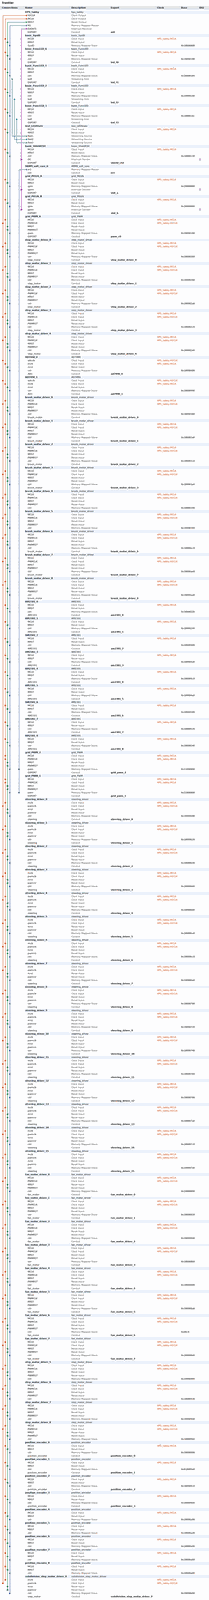
[diagram p0: system contents, whole]
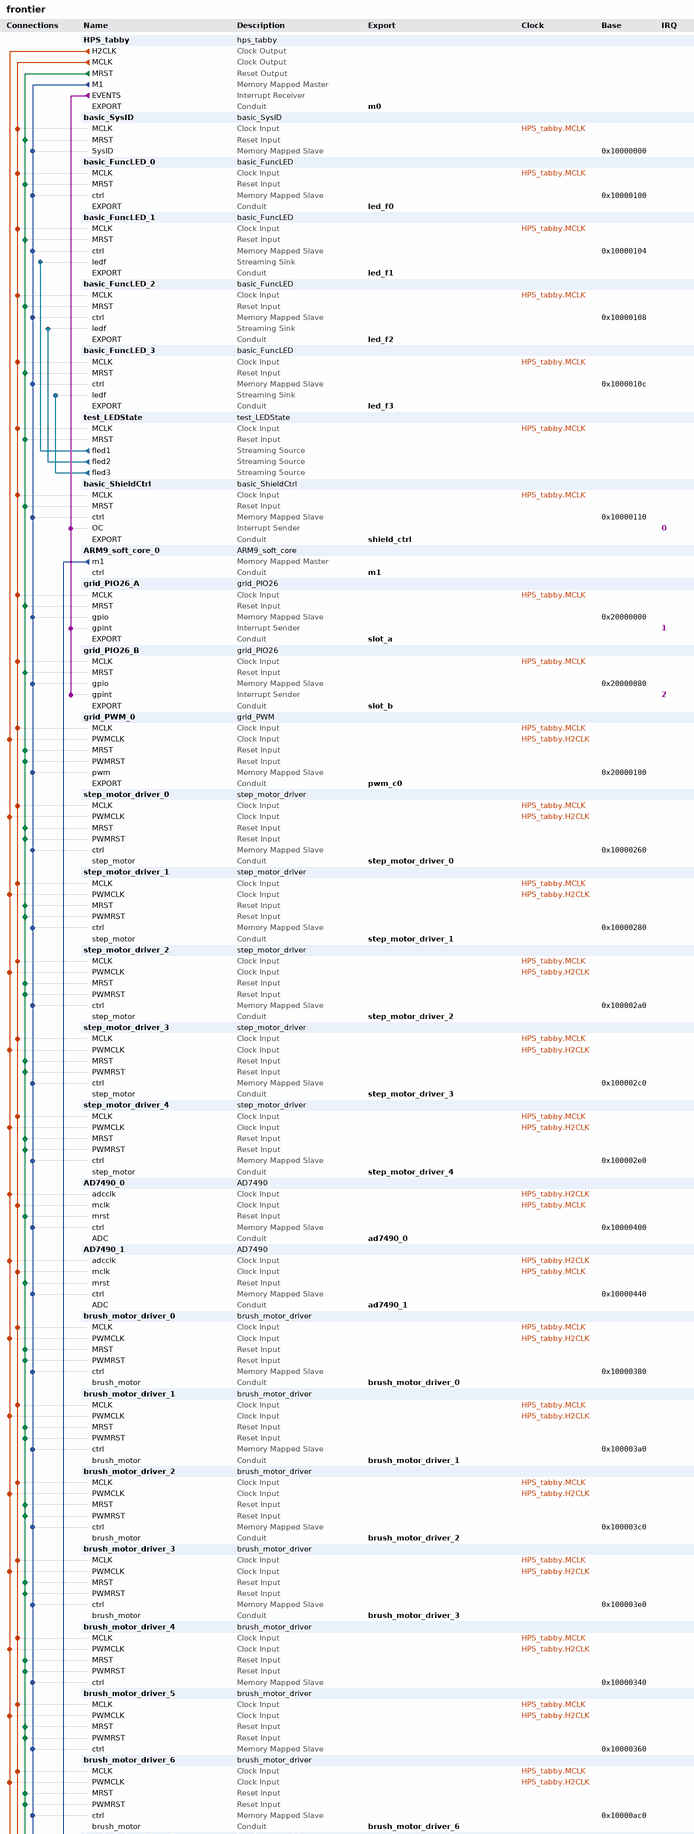
[diagram p1: system contents, upper part]
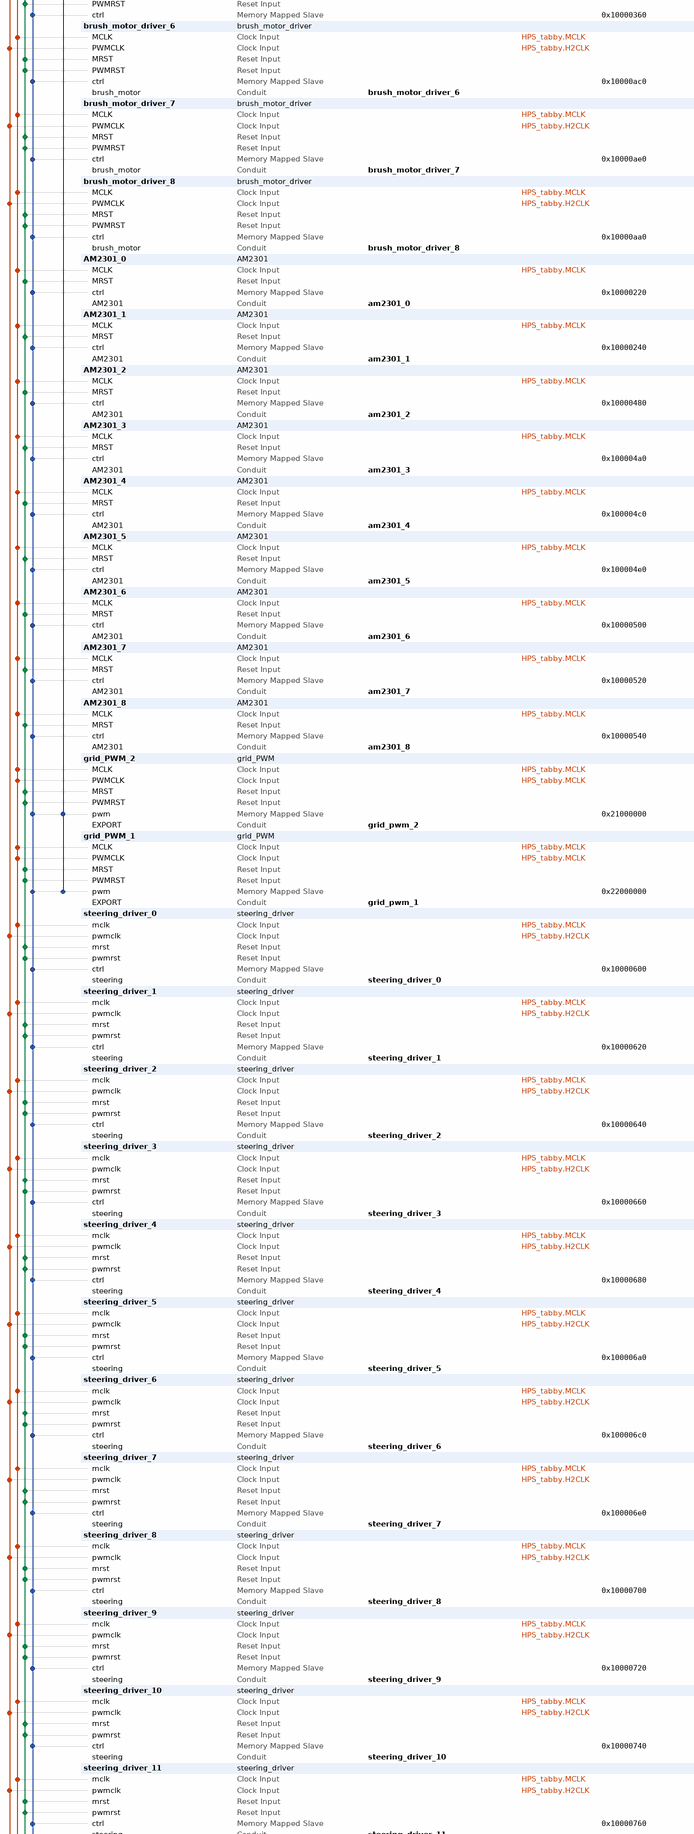
[diagram p2: system contents, middle part]
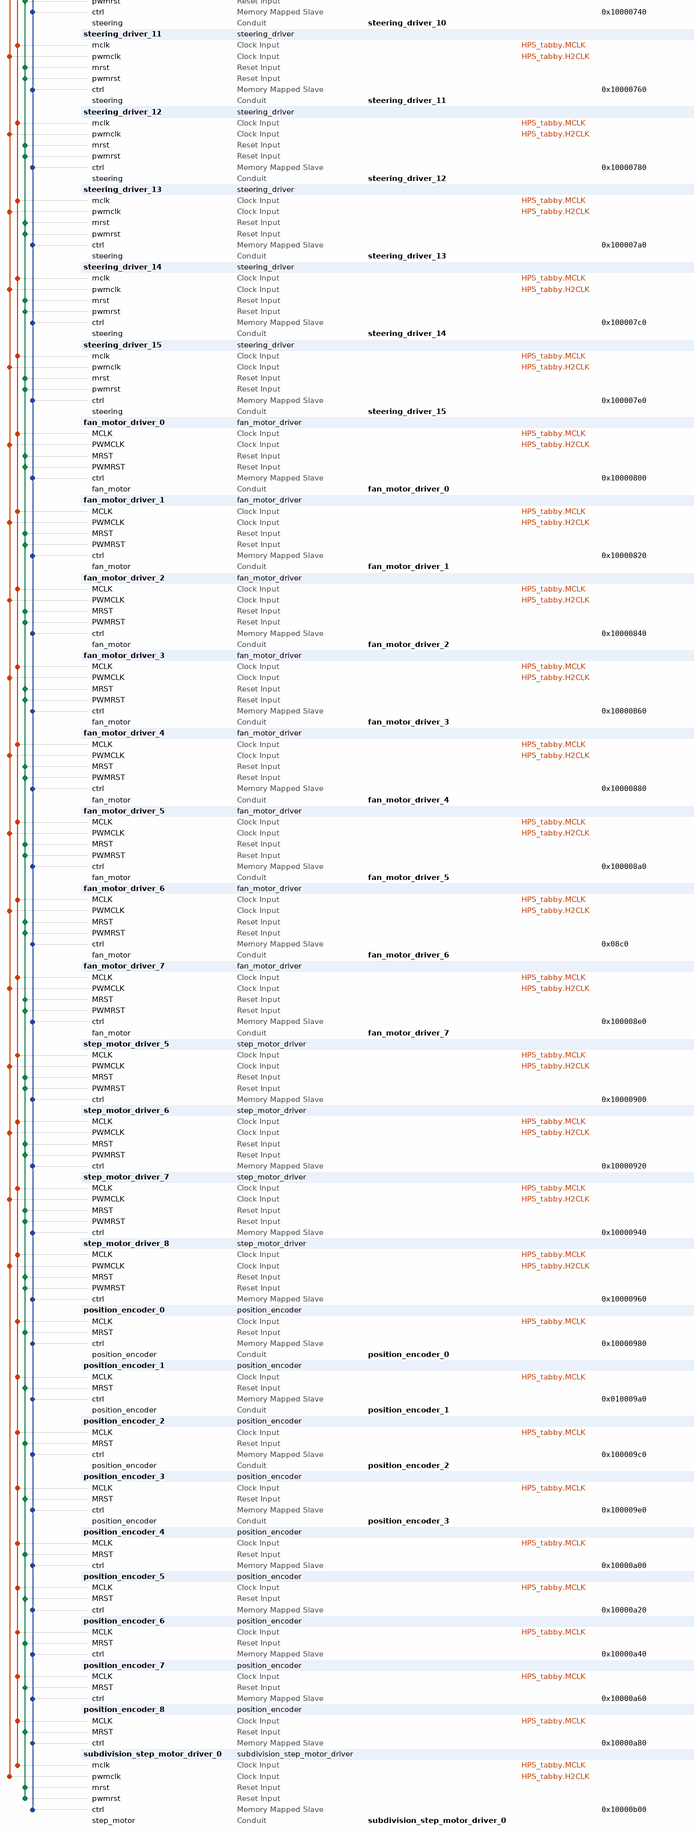
[diagram p3: system contents, lower part]
# Platform Designer (Qsys) system frontier, Cyclone IV E EP4CE15F23C8
# Parameters at their usual value, and those the tool derives, are not listed.
package require qsys
create_system frontier
set_project_property DEVICE_FAMILY {Cyclone IV E}
set_project_property DEVICE EP4CE15F23C8

add_instance HPS_tabby hps_tabby 1.1

add_instance basic_SysID basic_SysID 1.0

add_instance basic_FuncLED_0 basic_FuncLED 1.0

add_instance basic_FuncLED_1 basic_FuncLED 1.0

add_instance basic_FuncLED_2 basic_FuncLED 1.0

add_instance basic_FuncLED_3 basic_FuncLED 1.0

add_instance test_LEDState test_LEDState 1.0

add_instance basic_ShieldCtrl basic_ShieldCtrl 1.0

add_instance ARM9_soft_core_0 ARM9_soft_core 1.0

add_instance grid_PIO26_A grid_PIO26 1.0

add_instance grid_PIO26_B grid_PIO26 1.0

add_instance grid_PWM_0 grid_PWM 1.0

add_instance step_motor_driver_0 step_motor_driver 1.0

add_instance step_motor_driver_1 step_motor_driver 1.0

add_instance step_motor_driver_2 step_motor_driver 1.0

add_instance step_motor_driver_3 step_motor_driver 1.0

add_instance step_motor_driver_4 step_motor_driver 1.0

add_instance AD7490_0 AD7490 1.0

add_instance AD7490_1 AD7490 1.0

add_instance brush_motor_driver_0 brush_motor_driver 1.0

add_instance brush_motor_driver_1 brush_motor_driver 1.0

add_instance brush_motor_driver_2 brush_motor_driver 1.0

add_instance brush_motor_driver_3 brush_motor_driver 1.0

add_instance brush_motor_driver_4 brush_motor_driver 1.0

add_instance brush_motor_driver_5 brush_motor_driver 1.0

add_instance brush_motor_driver_6 brush_motor_driver 1.0

add_instance brush_motor_driver_7 brush_motor_driver 1.0

add_instance brush_motor_driver_8 brush_motor_driver 1.0

add_instance AM2301_0 AM2301 1.0
set_instance_parameter_value AM2301_0 high_width 20
set_instance_parameter_value AM2301_0 start_width 1000
set_instance_parameter_value AM2301_0 start 0
set_instance_parameter_value AM2301_0 start_read 1
set_instance_parameter_value AM2301_0 start_end 2
set_instance_parameter_value AM2301_0 start_low 3
set_instance_parameter_value AM2301_0 start_high 4
set_instance_parameter_value AM2301_0 bit_1_low 5
set_instance_parameter_value AM2301_0 bit_1_high 6
set_instance_parameter_value AM2301_0 bit_2_low 7
set_instance_parameter_value AM2301_0 bit_2_high 8
set_instance_parameter_value AM2301_0 bit_3_low 9
set_instance_parameter_value AM2301_0 bit_3_high 10
set_instance_parameter_value AM2301_0 bit_4_low 11
set_instance_parameter_value AM2301_0 bit_4_high 12
set_instance_parameter_value AM2301_0 bit_5_low 13
set_instance_parameter_value AM2301_0 bit_5_high 14
set_instance_parameter_value AM2301_0 bit_6_low 15
set_instance_parameter_value AM2301_0 bit_6_high 16
set_instance_parameter_value AM2301_0 bit_7_low 17
set_instance_parameter_value AM2301_0 bit_7_high 18
set_instance_parameter_value AM2301_0 bit_8_low 19
set_instance_parameter_value AM2301_0 bit_8_high 20
set_instance_parameter_value AM2301_0 bit_9_low 21
set_instance_parameter_value AM2301_0 bit_9_high 22
set_instance_parameter_value AM2301_0 bit_10_low 23
set_instance_parameter_value AM2301_0 bit_10_high 24
set_instance_parameter_value AM2301_0 bit_11_low 25
set_instance_parameter_value AM2301_0 bit_11_high 26
set_instance_parameter_value AM2301_0 bit_12_low 27
set_instance_parameter_value AM2301_0 bit_12_high 28
set_instance_parameter_value AM2301_0 bit_13_low 29
set_instance_parameter_value AM2301_0 bit_13_high 30
set_instance_parameter_value AM2301_0 bit_14_low 31
set_instance_parameter_value AM2301_0 bit_14_high 32
set_instance_parameter_value AM2301_0 bit_15_low 33
set_instance_parameter_value AM2301_0 bit_15_high 34
set_instance_parameter_value AM2301_0 bit_16_low 35
set_instance_parameter_value AM2301_0 bit_16_high 36
set_instance_parameter_value AM2301_0 bit_17_low 37
set_instance_parameter_value AM2301_0 bit_17_high 38
set_instance_parameter_value AM2301_0 bit_18_low 39
set_instance_parameter_value AM2301_0 bit_18_high 40
set_instance_parameter_value AM2301_0 bit_19_low 41
set_instance_parameter_value AM2301_0 bit_19_high 42
set_instance_parameter_value AM2301_0 bit_20_low 43
set_instance_parameter_value AM2301_0 bit_20_high 44
set_instance_parameter_value AM2301_0 bit_21_low 45
set_instance_parameter_value AM2301_0 bit_21_high 46
set_instance_parameter_value AM2301_0 bit_22_low 47
set_instance_parameter_value AM2301_0 bit_22_high 48
set_instance_parameter_value AM2301_0 bit_23_low 49
set_instance_parameter_value AM2301_0 bit_23_high 50
set_instance_parameter_value AM2301_0 bit_24_low 51
set_instance_parameter_value AM2301_0 bit_24_high 52
set_instance_parameter_value AM2301_0 bit_25_low 53
set_instance_parameter_value AM2301_0 bit_25_high 54
set_instance_parameter_value AM2301_0 bit_26_low 55
set_instance_parameter_value AM2301_0 bit_26_high 56
set_instance_parameter_value AM2301_0 bit_27_low 57
set_instance_parameter_value AM2301_0 bit_27_high 58
set_instance_parameter_value AM2301_0 bit_28_low 59
set_instance_parameter_value AM2301_0 bit_28_high 60
set_instance_parameter_value AM2301_0 bit_29_low 61
set_instance_parameter_value AM2301_0 bit_29_high 62
set_instance_parameter_value AM2301_0 bit_30_low 63
set_instance_parameter_value AM2301_0 bit_30_high 64
set_instance_parameter_value AM2301_0 bit_31_low 65
set_instance_parameter_value AM2301_0 bit_31_high 66
set_instance_parameter_value AM2301_0 bit_32_low 67
set_instance_parameter_value AM2301_0 bit_32_high 68
set_instance_parameter_value AM2301_0 ready 90
set_instance_parameter_value AM2301_0 time_2s 2000000

add_instance AM2301_1 AM2301 1.0
set_instance_parameter_value AM2301_1 high_width 20
set_instance_parameter_value AM2301_1 start_width 1000
set_instance_parameter_value AM2301_1 start 0
set_instance_parameter_value AM2301_1 start_read 1
set_instance_parameter_value AM2301_1 start_end 2
set_instance_parameter_value AM2301_1 start_low 3
set_instance_parameter_value AM2301_1 start_high 4
set_instance_parameter_value AM2301_1 bit_1_low 5
set_instance_parameter_value AM2301_1 bit_1_high 6
set_instance_parameter_value AM2301_1 bit_2_low 7
set_instance_parameter_value AM2301_1 bit_2_high 8
set_instance_parameter_value AM2301_1 bit_3_low 9
set_instance_parameter_value AM2301_1 bit_3_high 10
set_instance_parameter_value AM2301_1 bit_4_low 11
set_instance_parameter_value AM2301_1 bit_4_high 12
set_instance_parameter_value AM2301_1 bit_5_low 13
set_instance_parameter_value AM2301_1 bit_5_high 14
set_instance_parameter_value AM2301_1 bit_6_low 15
set_instance_parameter_value AM2301_1 bit_6_high 16
set_instance_parameter_value AM2301_1 bit_7_low 17
set_instance_parameter_value AM2301_1 bit_7_high 18
set_instance_parameter_value AM2301_1 bit_8_low 19
set_instance_parameter_value AM2301_1 bit_8_high 20
set_instance_parameter_value AM2301_1 bit_9_low 21
set_instance_parameter_value AM2301_1 bit_9_high 22
set_instance_parameter_value AM2301_1 bit_10_low 23
set_instance_parameter_value AM2301_1 bit_10_high 24
set_instance_parameter_value AM2301_1 bit_11_low 25
set_instance_parameter_value AM2301_1 bit_11_high 26
set_instance_parameter_value AM2301_1 bit_12_low 27
set_instance_parameter_value AM2301_1 bit_12_high 28
set_instance_parameter_value AM2301_1 bit_13_low 29
set_instance_parameter_value AM2301_1 bit_13_high 30
set_instance_parameter_value AM2301_1 bit_14_low 31
set_instance_parameter_value AM2301_1 bit_14_high 32
set_instance_parameter_value AM2301_1 bit_15_low 33
set_instance_parameter_value AM2301_1 bit_15_high 34
set_instance_parameter_value AM2301_1 bit_16_low 35
set_instance_parameter_value AM2301_1 bit_16_high 36
set_instance_parameter_value AM2301_1 bit_17_low 37
set_instance_parameter_value AM2301_1 bit_17_high 38
set_instance_parameter_value AM2301_1 bit_18_low 39
set_instance_parameter_value AM2301_1 bit_18_high 40
set_instance_parameter_value AM2301_1 bit_19_low 41
set_instance_parameter_value AM2301_1 bit_19_high 42
set_instance_parameter_value AM2301_1 bit_20_low 43
set_instance_parameter_value AM2301_1 bit_20_high 44
set_instance_parameter_value AM2301_1 bit_21_low 45
set_instance_parameter_value AM2301_1 bit_21_high 46
set_instance_parameter_value AM2301_1 bit_22_low 47
set_instance_parameter_value AM2301_1 bit_22_high 48
set_instance_parameter_value AM2301_1 bit_23_low 49
set_instance_parameter_value AM2301_1 bit_23_high 50
set_instance_parameter_value AM2301_1 bit_24_low 51
set_instance_parameter_value AM2301_1 bit_24_high 52
set_instance_parameter_value AM2301_1 bit_25_low 53
set_instance_parameter_value AM2301_1 bit_25_high 54
set_instance_parameter_value AM2301_1 bit_26_low 55
set_instance_parameter_value AM2301_1 bit_26_high 56
set_instance_parameter_value AM2301_1 bit_27_low 57
set_instance_parameter_value AM2301_1 bit_27_high 58
set_instance_parameter_value AM2301_1 bit_28_low 59
set_instance_parameter_value AM2301_1 bit_28_high 60
set_instance_parameter_value AM2301_1 bit_29_low 61
set_instance_parameter_value AM2301_1 bit_29_high 62
set_instance_parameter_value AM2301_1 bit_30_low 63
set_instance_parameter_value AM2301_1 bit_30_high 64
set_instance_parameter_value AM2301_1 bit_31_low 65
set_instance_parameter_value AM2301_1 bit_31_high 66
set_instance_parameter_value AM2301_1 bit_32_low 67
set_instance_parameter_value AM2301_1 bit_32_high 68
set_instance_parameter_value AM2301_1 ready 90
set_instance_parameter_value AM2301_1 time_2s 2000000

add_instance AM2301_2 AM2301 1.0
set_instance_parameter_value AM2301_2 high_width 20
set_instance_parameter_value AM2301_2 start_width 1000
set_instance_parameter_value AM2301_2 start 0
set_instance_parameter_value AM2301_2 start_read 1
set_instance_parameter_value AM2301_2 start_end 2
set_instance_parameter_value AM2301_2 start_low 3
set_instance_parameter_value AM2301_2 start_high 4
set_instance_parameter_value AM2301_2 bit_1_low 5
set_instance_parameter_value AM2301_2 bit_1_high 6
set_instance_parameter_value AM2301_2 bit_2_low 7
set_instance_parameter_value AM2301_2 bit_2_high 8
set_instance_parameter_value AM2301_2 bit_3_low 9
set_instance_parameter_value AM2301_2 bit_3_high 10
set_instance_parameter_value AM2301_2 bit_4_low 11
set_instance_parameter_value AM2301_2 bit_4_high 12
set_instance_parameter_value AM2301_2 bit_5_low 13
set_instance_parameter_value AM2301_2 bit_5_high 14
set_instance_parameter_value AM2301_2 bit_6_low 15
set_instance_parameter_value AM2301_2 bit_6_high 16
set_instance_parameter_value AM2301_2 bit_7_low 17
set_instance_parameter_value AM2301_2 bit_7_high 18
set_instance_parameter_value AM2301_2 bit_8_low 19
set_instance_parameter_value AM2301_2 bit_8_high 20
set_instance_parameter_value AM2301_2 bit_9_low 21
set_instance_parameter_value AM2301_2 bit_9_high 22
set_instance_parameter_value AM2301_2 bit_10_low 23
set_instance_parameter_value AM2301_2 bit_10_high 24
set_instance_parameter_value AM2301_2 bit_11_low 25
set_instance_parameter_value AM2301_2 bit_11_high 26
set_instance_parameter_value AM2301_2 bit_12_low 27
set_instance_parameter_value AM2301_2 bit_12_high 28
set_instance_parameter_value AM2301_2 bit_13_low 29
set_instance_parameter_value AM2301_2 bit_13_high 30
set_instance_parameter_value AM2301_2 bit_14_low 31
set_instance_parameter_value AM2301_2 bit_14_high 32
set_instance_parameter_value AM2301_2 bit_15_low 33
set_instance_parameter_value AM2301_2 bit_15_high 34
set_instance_parameter_value AM2301_2 bit_16_low 35
set_instance_parameter_value AM2301_2 bit_16_high 36
set_instance_parameter_value AM2301_2 bit_17_low 37
set_instance_parameter_value AM2301_2 bit_17_high 38
set_instance_parameter_value AM2301_2 bit_18_low 39
set_instance_parameter_value AM2301_2 bit_18_high 40
set_instance_parameter_value AM2301_2 bit_19_low 41
set_instance_parameter_value AM2301_2 bit_19_high 42
set_instance_parameter_value AM2301_2 bit_20_low 43
set_instance_parameter_value AM2301_2 bit_20_high 44
set_instance_parameter_value AM2301_2 bit_21_low 45
set_instance_parameter_value AM2301_2 bit_21_high 46
set_instance_parameter_value AM2301_2 bit_22_low 47
set_instance_parameter_value AM2301_2 bit_22_high 48
set_instance_parameter_value AM2301_2 bit_23_low 49
set_instance_parameter_value AM2301_2 bit_23_high 50
set_instance_parameter_value AM2301_2 bit_24_low 51
set_instance_parameter_value AM2301_2 bit_24_high 52
set_instance_parameter_value AM2301_2 bit_25_low 53
set_instance_parameter_value AM2301_2 bit_25_high 54
set_instance_parameter_value AM2301_2 bit_26_low 55
set_instance_parameter_value AM2301_2 bit_26_high 56
set_instance_parameter_value AM2301_2 bit_27_low 57
set_instance_parameter_value AM2301_2 bit_27_high 58
set_instance_parameter_value AM2301_2 bit_28_low 59
set_instance_parameter_value AM2301_2 bit_28_high 60
set_instance_parameter_value AM2301_2 bit_29_low 61
set_instance_parameter_value AM2301_2 bit_29_high 62
set_instance_parameter_value AM2301_2 bit_30_low 63
set_instance_parameter_value AM2301_2 bit_30_high 64
set_instance_parameter_value AM2301_2 bit_31_low 65
set_instance_parameter_value AM2301_2 bit_31_high 66
set_instance_parameter_value AM2301_2 bit_32_low 67
set_instance_parameter_value AM2301_2 bit_32_high 68
set_instance_parameter_value AM2301_2 ready 90
set_instance_parameter_value AM2301_2 time_2s 2000000

add_instance AM2301_3 AM2301 1.0
set_instance_parameter_value AM2301_3 high_width 20
set_instance_parameter_value AM2301_3 start_width 1000
set_instance_parameter_value AM2301_3 start 0
set_instance_parameter_value AM2301_3 start_read 1
set_instance_parameter_value AM2301_3 start_end 2
set_instance_parameter_value AM2301_3 start_low 3
set_instance_parameter_value AM2301_3 start_high 4
set_instance_parameter_value AM2301_3 bit_1_low 5
set_instance_parameter_value AM2301_3 bit_1_high 6
set_instance_parameter_value AM2301_3 bit_2_low 7
set_instance_parameter_value AM2301_3 bit_2_high 8
set_instance_parameter_value AM2301_3 bit_3_low 9
set_instance_parameter_value AM2301_3 bit_3_high 10
set_instance_parameter_value AM2301_3 bit_4_low 11
set_instance_parameter_value AM2301_3 bit_4_high 12
set_instance_parameter_value AM2301_3 bit_5_low 13
set_instance_parameter_value AM2301_3 bit_5_high 14
set_instance_parameter_value AM2301_3 bit_6_low 15
set_instance_parameter_value AM2301_3 bit_6_high 16
set_instance_parameter_value AM2301_3 bit_7_low 17
set_instance_parameter_value AM2301_3 bit_7_high 18
set_instance_parameter_value AM2301_3 bit_8_low 19
set_instance_parameter_value AM2301_3 bit_8_high 20
set_instance_parameter_value AM2301_3 bit_9_low 21
set_instance_parameter_value AM2301_3 bit_9_high 22
set_instance_parameter_value AM2301_3 bit_10_low 23
set_instance_parameter_value AM2301_3 bit_10_high 24
set_instance_parameter_value AM2301_3 bit_11_low 25
set_instance_parameter_value AM2301_3 bit_11_high 26
set_instance_parameter_value AM2301_3 bit_12_low 27
set_instance_parameter_value AM2301_3 bit_12_high 28
set_instance_parameter_value AM2301_3 bit_13_low 29
set_instance_parameter_value AM2301_3 bit_13_high 30
set_instance_parameter_value AM2301_3 bit_14_low 31
set_instance_parameter_value AM2301_3 bit_14_high 32
set_instance_parameter_value AM2301_3 bit_15_low 33
set_instance_parameter_value AM2301_3 bit_15_high 34
set_instance_parameter_value AM2301_3 bit_16_low 35
set_instance_parameter_value AM2301_3 bit_16_high 36
set_instance_parameter_value AM2301_3 bit_17_low 37
set_instance_parameter_value AM2301_3 bit_17_high 38
set_instance_parameter_value AM2301_3 bit_18_low 39
set_instance_parameter_value AM2301_3 bit_18_high 40
set_instance_parameter_value AM2301_3 bit_19_low 41
set_instance_parameter_value AM2301_3 bit_19_high 42
set_instance_parameter_value AM2301_3 bit_20_low 43
set_instance_parameter_value AM2301_3 bit_20_high 44
set_instance_parameter_value AM2301_3 bit_21_low 45
set_instance_parameter_value AM2301_3 bit_21_high 46
set_instance_parameter_value AM2301_3 bit_22_low 47
set_instance_parameter_value AM2301_3 bit_22_high 48
set_instance_parameter_value AM2301_3 bit_23_low 49
set_instance_parameter_value AM2301_3 bit_23_high 50
set_instance_parameter_value AM2301_3 bit_24_low 51
set_instance_parameter_value AM2301_3 bit_24_high 52
set_instance_parameter_value AM2301_3 bit_25_low 53
set_instance_parameter_value AM2301_3 bit_25_high 54
set_instance_parameter_value AM2301_3 bit_26_low 55
set_instance_parameter_value AM2301_3 bit_26_high 56
set_instance_parameter_value AM2301_3 bit_27_low 57
set_instance_parameter_value AM2301_3 bit_27_high 58
set_instance_parameter_value AM2301_3 bit_28_low 59
set_instance_parameter_value AM2301_3 bit_28_high 60
set_instance_parameter_value AM2301_3 bit_29_low 61
set_instance_parameter_value AM2301_3 bit_29_high 62
set_instance_parameter_value AM2301_3 bit_30_low 63
set_instance_parameter_value AM2301_3 bit_30_high 64
set_instance_parameter_value AM2301_3 bit_31_low 65
set_instance_parameter_value AM2301_3 bit_31_high 66
set_instance_parameter_value AM2301_3 bit_32_low 67
set_instance_parameter_value AM2301_3 bit_32_high 68
set_instance_parameter_value AM2301_3 ready 90
set_instance_parameter_value AM2301_3 time_2s 2000000

add_instance AM2301_4 AM2301 1.0
set_instance_parameter_value AM2301_4 high_width 20
set_instance_parameter_value AM2301_4 start_width 1000
set_instance_parameter_value AM2301_4 start 0
set_instance_parameter_value AM2301_4 start_read 1
set_instance_parameter_value AM2301_4 start_end 2
set_instance_parameter_value AM2301_4 start_low 3
set_instance_parameter_value AM2301_4 start_high 4
set_instance_parameter_value AM2301_4 bit_1_low 5
set_instance_parameter_value AM2301_4 bit_1_high 6
set_instance_parameter_value AM2301_4 bit_2_low 7
set_instance_parameter_value AM2301_4 bit_2_high 8
set_instance_parameter_value AM2301_4 bit_3_low 9
set_instance_parameter_value AM2301_4 bit_3_high 10
set_instance_parameter_value AM2301_4 bit_4_low 11
set_instance_parameter_value AM2301_4 bit_4_high 12
set_instance_parameter_value AM2301_4 bit_5_low 13
set_instance_parameter_value AM2301_4 bit_5_high 14
set_instance_parameter_value AM2301_4 bit_6_low 15
set_instance_parameter_value AM2301_4 bit_6_high 16
set_instance_parameter_value AM2301_4 bit_7_low 17
set_instance_parameter_value AM2301_4 bit_7_high 18
set_instance_parameter_value AM2301_4 bit_8_low 19
set_instance_parameter_value AM2301_4 bit_8_high 20
set_instance_parameter_value AM2301_4 bit_9_low 21
set_instance_parameter_value AM2301_4 bit_9_high 22
set_instance_parameter_value AM2301_4 bit_10_low 23
set_instance_parameter_value AM2301_4 bit_10_high 24
set_instance_parameter_value AM2301_4 bit_11_low 25
set_instance_parameter_value AM2301_4 bit_11_high 26
set_instance_parameter_value AM2301_4 bit_12_low 27
set_instance_parameter_value AM2301_4 bit_12_high 28
set_instance_parameter_value AM2301_4 bit_13_low 29
set_instance_parameter_value AM2301_4 bit_13_high 30
set_instance_parameter_value AM2301_4 bit_14_low 31
set_instance_parameter_value AM2301_4 bit_14_high 32
set_instance_parameter_value AM2301_4 bit_15_low 33
set_instance_parameter_value AM2301_4 bit_15_high 34
set_instance_parameter_value AM2301_4 bit_16_low 35
set_instance_parameter_value AM2301_4 bit_16_high 36
set_instance_parameter_value AM2301_4 bit_17_low 37
set_instance_parameter_value AM2301_4 bit_17_high 38
set_instance_parameter_value AM2301_4 bit_18_low 39
set_instance_parameter_value AM2301_4 bit_18_high 40
set_instance_parameter_value AM2301_4 bit_19_low 41
set_instance_parameter_value AM2301_4 bit_19_high 42
set_instance_parameter_value AM2301_4 bit_20_low 43
set_instance_parameter_value AM2301_4 bit_20_high 44
set_instance_parameter_value AM2301_4 bit_21_low 45
set_instance_parameter_value AM2301_4 bit_21_high 46
set_instance_parameter_value AM2301_4 bit_22_low 47
set_instance_parameter_value AM2301_4 bit_22_high 48
set_instance_parameter_value AM2301_4 bit_23_low 49
set_instance_parameter_value AM2301_4 bit_23_high 50
set_instance_parameter_value AM2301_4 bit_24_low 51
set_instance_parameter_value AM2301_4 bit_24_high 52
set_instance_parameter_value AM2301_4 bit_25_low 53
set_instance_parameter_value AM2301_4 bit_25_high 54
set_instance_parameter_value AM2301_4 bit_26_low 55
set_instance_parameter_value AM2301_4 bit_26_high 56
set_instance_parameter_value AM2301_4 bit_27_low 57
set_instance_parameter_value AM2301_4 bit_27_high 58
set_instance_parameter_value AM2301_4 bit_28_low 59
set_instance_parameter_value AM2301_4 bit_28_high 60
set_instance_parameter_value AM2301_4 bit_29_low 61
set_instance_parameter_value AM2301_4 bit_29_high 62
set_instance_parameter_value AM2301_4 bit_30_low 63
set_instance_parameter_value AM2301_4 bit_30_high 64
set_instance_parameter_value AM2301_4 bit_31_low 65
set_instance_parameter_value AM2301_4 bit_31_high 66
set_instance_parameter_value AM2301_4 bit_32_low 67
set_instance_parameter_value AM2301_4 bit_32_high 68
set_instance_parameter_value AM2301_4 ready 90
set_instance_parameter_value AM2301_4 time_2s 2000000

add_instance AM2301_5 AM2301 1.0
set_instance_parameter_value AM2301_5 high_width 20
set_instance_parameter_value AM2301_5 start_width 1000
set_instance_parameter_value AM2301_5 start 0
set_instance_parameter_value AM2301_5 start_read 1
set_instance_parameter_value AM2301_5 start_end 2
set_instance_parameter_value AM2301_5 start_low 3
set_instance_parameter_value AM2301_5 start_high 4
set_instance_parameter_value AM2301_5 bit_1_low 5
set_instance_parameter_value AM2301_5 bit_1_high 6
set_instance_parameter_value AM2301_5 bit_2_low 7
set_instance_parameter_value AM2301_5 bit_2_high 8
set_instance_parameter_value AM2301_5 bit_3_low 9
set_instance_parameter_value AM2301_5 bit_3_high 10
set_instance_parameter_value AM2301_5 bit_4_low 11
set_instance_parameter_value AM2301_5 bit_4_high 12
set_instance_parameter_value AM2301_5 bit_5_low 13
set_instance_parameter_value AM2301_5 bit_5_high 14
set_instance_parameter_value AM2301_5 bit_6_low 15
set_instance_parameter_value AM2301_5 bit_6_high 16
set_instance_parameter_value AM2301_5 bit_7_low 17
set_instance_parameter_value AM2301_5 bit_7_high 18
set_instance_parameter_value AM2301_5 bit_8_low 19
set_instance_parameter_value AM2301_5 bit_8_high 20
set_instance_parameter_value AM2301_5 bit_9_low 21
set_instance_parameter_value AM2301_5 bit_9_high 22
set_instance_parameter_value AM2301_5 bit_10_low 23
set_instance_parameter_value AM2301_5 bit_10_high 24
set_instance_parameter_value AM2301_5 bit_11_low 25
set_instance_parameter_value AM2301_5 bit_11_high 26
set_instance_parameter_value AM2301_5 bit_12_low 27
set_instance_parameter_value AM2301_5 bit_12_high 28
set_instance_parameter_value AM2301_5 bit_13_low 29
set_instance_parameter_value AM2301_5 bit_13_high 30
set_instance_parameter_value AM2301_5 bit_14_low 31
set_instance_parameter_value AM2301_5 bit_14_high 32
set_instance_parameter_value AM2301_5 bit_15_low 33
set_instance_parameter_value AM2301_5 bit_15_high 34
set_instance_parameter_value AM2301_5 bit_16_low 35
set_instance_parameter_value AM2301_5 bit_16_high 36
set_instance_parameter_value AM2301_5 bit_17_low 37
set_instance_parameter_value AM2301_5 bit_17_high 38
set_instance_parameter_value AM2301_5 bit_18_low 39
set_instance_parameter_value AM2301_5 bit_18_high 40
set_instance_parameter_value AM2301_5 bit_19_low 41
set_instance_parameter_value AM2301_5 bit_19_high 42
set_instance_parameter_value AM2301_5 bit_20_low 43
set_instance_parameter_value AM2301_5 bit_20_high 44
set_instance_parameter_value AM2301_5 bit_21_low 45
set_instance_parameter_value AM2301_5 bit_21_high 46
set_instance_parameter_value AM2301_5 bit_22_low 47
set_instance_parameter_value AM2301_5 bit_22_high 48
set_instance_parameter_value AM2301_5 bit_23_low 49
set_instance_parameter_value AM2301_5 bit_23_high 50
set_instance_parameter_value AM2301_5 bit_24_low 51
set_instance_parameter_value AM2301_5 bit_24_high 52
set_instance_parameter_value AM2301_5 bit_25_low 53
set_instance_parameter_value AM2301_5 bit_25_high 54
set_instance_parameter_value AM2301_5 bit_26_low 55
set_instance_parameter_value AM2301_5 bit_26_high 56
set_instance_parameter_value AM2301_5 bit_27_low 57
set_instance_parameter_value AM2301_5 bit_27_high 58
set_instance_parameter_value AM2301_5 bit_28_low 59
set_instance_parameter_value AM2301_5 bit_28_high 60
set_instance_parameter_value AM2301_5 bit_29_low 61
set_instance_parameter_value AM2301_5 bit_29_high 62
set_instance_parameter_value AM2301_5 bit_30_low 63
set_instance_parameter_value AM2301_5 bit_30_high 64
set_instance_parameter_value AM2301_5 bit_31_low 65
set_instance_parameter_value AM2301_5 bit_31_high 66
set_instance_parameter_value AM2301_5 bit_32_low 67
set_instance_parameter_value AM2301_5 bit_32_high 68
set_instance_parameter_value AM2301_5 ready 90
set_instance_parameter_value AM2301_5 time_2s 2000000

add_instance AM2301_6 AM2301 1.0
set_instance_parameter_value AM2301_6 high_width 20
set_instance_parameter_value AM2301_6 start_width 1000
set_instance_parameter_value AM2301_6 start 0
set_instance_parameter_value AM2301_6 start_read 1
set_instance_parameter_value AM2301_6 start_end 2
set_instance_parameter_value AM2301_6 start_low 3
set_instance_parameter_value AM2301_6 start_high 4
set_instance_parameter_value AM2301_6 bit_1_low 5
set_instance_parameter_value AM2301_6 bit_1_high 6
set_instance_parameter_value AM2301_6 bit_2_low 7
set_instance_parameter_value AM2301_6 bit_2_high 8
set_instance_parameter_value AM2301_6 bit_3_low 9
set_instance_parameter_value AM2301_6 bit_3_high 10
set_instance_parameter_value AM2301_6 bit_4_low 11
set_instance_parameter_value AM2301_6 bit_4_high 12
set_instance_parameter_value AM2301_6 bit_5_low 13
set_instance_parameter_value AM2301_6 bit_5_high 14
set_instance_parameter_value AM2301_6 bit_6_low 15
set_instance_parameter_value AM2301_6 bit_6_high 16
set_instance_parameter_value AM2301_6 bit_7_low 17
set_instance_parameter_value AM2301_6 bit_7_high 18
set_instance_parameter_value AM2301_6 bit_8_low 19
set_instance_parameter_value AM2301_6 bit_8_high 20
set_instance_parameter_value AM2301_6 bit_9_low 21
set_instance_parameter_value AM2301_6 bit_9_high 22
set_instance_parameter_value AM2301_6 bit_10_low 23
set_instance_parameter_value AM2301_6 bit_10_high 24
set_instance_parameter_value AM2301_6 bit_11_low 25
set_instance_parameter_value AM2301_6 bit_11_high 26
set_instance_parameter_value AM2301_6 bit_12_low 27
set_instance_parameter_value AM2301_6 bit_12_high 28
set_instance_parameter_value AM2301_6 bit_13_low 29
set_instance_parameter_value AM2301_6 bit_13_high 30
set_instance_parameter_value AM2301_6 bit_14_low 31
set_instance_parameter_value AM2301_6 bit_14_high 32
set_instance_parameter_value AM2301_6 bit_15_low 33
set_instance_parameter_value AM2301_6 bit_15_high 34
set_instance_parameter_value AM2301_6 bit_16_low 35
set_instance_parameter_value AM2301_6 bit_16_high 36
set_instance_parameter_value AM2301_6 bit_17_low 37
set_instance_parameter_value AM2301_6 bit_17_high 38
set_instance_parameter_value AM2301_6 bit_18_low 39
set_instance_parameter_value AM2301_6 bit_18_high 40
set_instance_parameter_value AM2301_6 bit_19_low 41
set_instance_parameter_value AM2301_6 bit_19_high 42
set_instance_parameter_value AM2301_6 bit_20_low 43
set_instance_parameter_value AM2301_6 bit_20_high 44
set_instance_parameter_value AM2301_6 bit_21_low 45
set_instance_parameter_value AM2301_6 bit_21_high 46
set_instance_parameter_value AM2301_6 bit_22_low 47
set_instance_parameter_value AM2301_6 bit_22_high 48
set_instance_parameter_value AM2301_6 bit_23_low 49
set_instance_parameter_value AM2301_6 bit_23_high 50
set_instance_parameter_value AM2301_6 bit_24_low 51
set_instance_parameter_value AM2301_6 bit_24_high 52
set_instance_parameter_value AM2301_6 bit_25_low 53
set_instance_parameter_value AM2301_6 bit_25_high 54
set_instance_parameter_value AM2301_6 bit_26_low 55
set_instance_parameter_value AM2301_6 bit_26_high 56
set_instance_parameter_value AM2301_6 bit_27_low 57
set_instance_parameter_value AM2301_6 bit_27_high 58
set_instance_parameter_value AM2301_6 bit_28_low 59
set_instance_parameter_value AM2301_6 bit_28_high 60
set_instance_parameter_value AM2301_6 bit_29_low 61
set_instance_parameter_value AM2301_6 bit_29_high 62
set_instance_parameter_value AM2301_6 bit_30_low 63
set_instance_parameter_value AM2301_6 bit_30_high 64
set_instance_parameter_value AM2301_6 bit_31_low 65
set_instance_parameter_value AM2301_6 bit_31_high 66
set_instance_parameter_value AM2301_6 bit_32_low 67
set_instance_parameter_value AM2301_6 bit_32_high 68
set_instance_parameter_value AM2301_6 ready 90
set_instance_parameter_value AM2301_6 time_2s 2000000

add_instance AM2301_7 AM2301 1.0
set_instance_parameter_value AM2301_7 high_width 20
set_instance_parameter_value AM2301_7 start_width 1000
set_instance_parameter_value AM2301_7 start 0
set_instance_parameter_value AM2301_7 start_read 1
set_instance_parameter_value AM2301_7 start_end 2
set_instance_parameter_value AM2301_7 start_low 3
set_instance_parameter_value AM2301_7 start_high 4
set_instance_parameter_value AM2301_7 bit_1_low 5
set_instance_parameter_value AM2301_7 bit_1_high 6
set_instance_parameter_value AM2301_7 bit_2_low 7
set_instance_parameter_value AM2301_7 bit_2_high 8
set_instance_parameter_value AM2301_7 bit_3_low 9
set_instance_parameter_value AM2301_7 bit_3_high 10
set_instance_parameter_value AM2301_7 bit_4_low 11
set_instance_parameter_value AM2301_7 bit_4_high 12
set_instance_parameter_value AM2301_7 bit_5_low 13
set_instance_parameter_value AM2301_7 bit_5_high 14
set_instance_parameter_value AM2301_7 bit_6_low 15
set_instance_parameter_value AM2301_7 bit_6_high 16
set_instance_parameter_value AM2301_7 bit_7_low 17
set_instance_parameter_value AM2301_7 bit_7_high 18
set_instance_parameter_value AM2301_7 bit_8_low 19
set_instance_parameter_value AM2301_7 bit_8_high 20
set_instance_parameter_value AM2301_7 bit_9_low 21
set_instance_parameter_value AM2301_7 bit_9_high 22
set_instance_parameter_value AM2301_7 bit_10_low 23
set_instance_parameter_value AM2301_7 bit_10_high 24
set_instance_parameter_value AM2301_7 bit_11_low 25
set_instance_parameter_value AM2301_7 bit_11_high 26
set_instance_parameter_value AM2301_7 bit_12_low 27
set_instance_parameter_value AM2301_7 bit_12_high 28
set_instance_parameter_value AM2301_7 bit_13_low 29
set_instance_parameter_value AM2301_7 bit_13_high 30
set_instance_parameter_value AM2301_7 bit_14_low 31
set_instance_parameter_value AM2301_7 bit_14_high 32
set_instance_parameter_value AM2301_7 bit_15_low 33
set_instance_parameter_value AM2301_7 bit_15_high 34
set_instance_parameter_value AM2301_7 bit_16_low 35
set_instance_parameter_value AM2301_7 bit_16_high 36
set_instance_parameter_value AM2301_7 bit_17_low 37
set_instance_parameter_value AM2301_7 bit_17_high 38
set_instance_parameter_value AM2301_7 bit_18_low 39
set_instance_parameter_value AM2301_7 bit_18_high 40
set_instance_parameter_value AM2301_7 bit_19_low 41
set_instance_parameter_value AM2301_7 bit_19_high 42
set_instance_parameter_value AM2301_7 bit_20_low 43
set_instance_parameter_value AM2301_7 bit_20_high 44
set_instance_parameter_value AM2301_7 bit_21_low 45
set_instance_parameter_value AM2301_7 bit_21_high 46
set_instance_parameter_value AM2301_7 bit_22_low 47
set_instance_parameter_value AM2301_7 bit_22_high 48
set_instance_parameter_value AM2301_7 bit_23_low 49
set_instance_parameter_value AM2301_7 bit_23_high 50
set_instance_parameter_value AM2301_7 bit_24_low 51
set_instance_parameter_value AM2301_7 bit_24_high 52
set_instance_parameter_value AM2301_7 bit_25_low 53
set_instance_parameter_value AM2301_7 bit_25_high 54
set_instance_parameter_value AM2301_7 bit_26_low 55
set_instance_parameter_value AM2301_7 bit_26_high 56
set_instance_parameter_value AM2301_7 bit_27_low 57
set_instance_parameter_value AM2301_7 bit_27_high 58
set_instance_parameter_value AM2301_7 bit_28_low 59
set_instance_parameter_value AM2301_7 bit_28_high 60
set_instance_parameter_value AM2301_7 bit_29_low 61
set_instance_parameter_value AM2301_7 bit_29_high 62
set_instance_parameter_value AM2301_7 bit_30_low 63
set_instance_parameter_value AM2301_7 bit_30_high 64
set_instance_parameter_value AM2301_7 bit_31_low 65
set_instance_parameter_value AM2301_7 bit_31_high 66
set_instance_parameter_value AM2301_7 bit_32_low 67
set_instance_parameter_value AM2301_7 bit_32_high 68
set_instance_parameter_value AM2301_7 ready 90
set_instance_parameter_value AM2301_7 time_2s 2000000

add_instance AM2301_8 AM2301 1.0
set_instance_parameter_value AM2301_8 high_width 20
set_instance_parameter_value AM2301_8 start_width 1000
set_instance_parameter_value AM2301_8 start 0
set_instance_parameter_value AM2301_8 start_read 1
set_instance_parameter_value AM2301_8 start_end 2
set_instance_parameter_value AM2301_8 start_low 3
set_instance_parameter_value AM2301_8 start_high 4
set_instance_parameter_value AM2301_8 bit_1_low 5
set_instance_parameter_value AM2301_8 bit_1_high 6
set_instance_parameter_value AM2301_8 bit_2_low 7
set_instance_parameter_value AM2301_8 bit_2_high 8
set_instance_parameter_value AM2301_8 bit_3_low 9
set_instance_parameter_value AM2301_8 bit_3_high 10
set_instance_parameter_value AM2301_8 bit_4_low 11
set_instance_parameter_value AM2301_8 bit_4_high 12
set_instance_parameter_value AM2301_8 bit_5_low 13
set_instance_parameter_value AM2301_8 bit_5_high 14
set_instance_parameter_value AM2301_8 bit_6_low 15
set_instance_parameter_value AM2301_8 bit_6_high 16
set_instance_parameter_value AM2301_8 bit_7_low 17
set_instance_parameter_value AM2301_8 bit_7_high 18
set_instance_parameter_value AM2301_8 bit_8_low 19
set_instance_parameter_value AM2301_8 bit_8_high 20
set_instance_parameter_value AM2301_8 bit_9_low 21
set_instance_parameter_value AM2301_8 bit_9_high 22
set_instance_parameter_value AM2301_8 bit_10_low 23
set_instance_parameter_value AM2301_8 bit_10_high 24
set_instance_parameter_value AM2301_8 bit_11_low 25
set_instance_parameter_value AM2301_8 bit_11_high 26
set_instance_parameter_value AM2301_8 bit_12_low 27
set_instance_parameter_value AM2301_8 bit_12_high 28
set_instance_parameter_value AM2301_8 bit_13_low 29
set_instance_parameter_value AM2301_8 bit_13_high 30
set_instance_parameter_value AM2301_8 bit_14_low 31
set_instance_parameter_value AM2301_8 bit_14_high 32
set_instance_parameter_value AM2301_8 bit_15_low 33
set_instance_parameter_value AM2301_8 bit_15_high 34
set_instance_parameter_value AM2301_8 bit_16_low 35
set_instance_parameter_value AM2301_8 bit_16_high 36
set_instance_parameter_value AM2301_8 bit_17_low 37
set_instance_parameter_value AM2301_8 bit_17_high 38
set_instance_parameter_value AM2301_8 bit_18_low 39
set_instance_parameter_value AM2301_8 bit_18_high 40
set_instance_parameter_value AM2301_8 bit_19_low 41
set_instance_parameter_value AM2301_8 bit_19_high 42
set_instance_parameter_value AM2301_8 bit_20_low 43
set_instance_parameter_value AM2301_8 bit_20_high 44
set_instance_parameter_value AM2301_8 bit_21_low 45
set_instance_parameter_value AM2301_8 bit_21_high 46
set_instance_parameter_value AM2301_8 bit_22_low 47
set_instance_parameter_value AM2301_8 bit_22_high 48
set_instance_parameter_value AM2301_8 bit_23_low 49
set_instance_parameter_value AM2301_8 bit_23_high 50
set_instance_parameter_value AM2301_8 bit_24_low 51
set_instance_parameter_value AM2301_8 bit_24_high 52
set_instance_parameter_value AM2301_8 bit_25_low 53
set_instance_parameter_value AM2301_8 bit_25_high 54
set_instance_parameter_value AM2301_8 bit_26_low 55
set_instance_parameter_value AM2301_8 bit_26_high 56
set_instance_parameter_value AM2301_8 bit_27_low 57
set_instance_parameter_value AM2301_8 bit_27_high 58
set_instance_parameter_value AM2301_8 bit_28_low 59
set_instance_parameter_value AM2301_8 bit_28_high 60
set_instance_parameter_value AM2301_8 bit_29_low 61
set_instance_parameter_value AM2301_8 bit_29_high 62
set_instance_parameter_value AM2301_8 bit_30_low 63
set_instance_parameter_value AM2301_8 bit_30_high 64
set_instance_parameter_value AM2301_8 bit_31_low 65
set_instance_parameter_value AM2301_8 bit_31_high 66
set_instance_parameter_value AM2301_8 bit_32_low 67
set_instance_parameter_value AM2301_8 bit_32_high 68
set_instance_parameter_value AM2301_8 ready 90
set_instance_parameter_value AM2301_8 time_2s 2000000

add_instance grid_PWM_2 grid_PWM 1.0

add_instance grid_PWM_1 grid_PWM 1.0

add_instance steering_driver_0 steering_driver 1.0

add_instance steering_driver_1 steering_driver 1.0

add_instance steering_driver_2 steering_driver 1.0

add_instance steering_driver_3 steering_driver 1.0

add_instance steering_driver_4 steering_driver 1.0

add_instance steering_driver_5 steering_driver 1.0

add_instance steering_driver_6 steering_driver 1.0

add_instance steering_driver_7 steering_driver 1.0

add_instance steering_driver_8 steering_driver 1.0

add_instance steering_driver_9 steering_driver 1.0

add_instance steering_driver_10 steering_driver 1.0

add_instance steering_driver_11 steering_driver 1.0

add_instance steering_driver_12 steering_driver 1.0

add_instance steering_driver_13 steering_driver 1.0

add_instance steering_driver_14 steering_driver 1.0

add_instance steering_driver_15 steering_driver 1.0

add_instance fan_motor_driver_0 fan_motor_driver 1.0

add_instance fan_motor_driver_1 fan_motor_driver 1.0

add_instance fan_motor_driver_2 fan_motor_driver 1.0

add_instance fan_motor_driver_3 fan_motor_driver 1.0

add_instance fan_motor_driver_4 fan_motor_driver 1.0

add_instance fan_motor_driver_5 fan_motor_driver 1.0

add_instance fan_motor_driver_6 fan_motor_driver 1.0

add_instance fan_motor_driver_7 fan_motor_driver 1.0

add_instance step_motor_driver_5 step_motor_driver 1.0

add_instance step_motor_driver_6 step_motor_driver 1.0

add_instance step_motor_driver_7 step_motor_driver 1.0

add_instance step_motor_driver_8 step_motor_driver 1.0

add_instance position_encoder_0 position_encoder 1.0

add_instance position_encoder_1 position_encoder 1.0

add_instance position_encoder_2 position_encoder 1.0

add_instance position_encoder_3 position_encoder 1.0

add_instance position_encoder_4 position_encoder 1.0

add_instance position_encoder_5 position_encoder 1.0

add_instance position_encoder_6 position_encoder 1.0

add_instance position_encoder_7 position_encoder 1.0

add_instance position_encoder_8 position_encoder 1.0

add_instance subdivision_step_motor_driver_0 subdivision_step_motor_driver 1.0

# connections
add_connection HPS_tabby.H2CLK AD7490_0.adcclk clock
add_connection HPS_tabby.H2CLK AD7490_1.adcclk clock
add_connection HPS_tabby.H2CLK brush_motor_driver_0.PWMCLK clock
add_connection HPS_tabby.H2CLK brush_motor_driver_1.PWMCLK clock
add_connection HPS_tabby.H2CLK brush_motor_driver_2.PWMCLK clock
add_connection HPS_tabby.H2CLK brush_motor_driver_3.PWMCLK clock
add_connection HPS_tabby.H2CLK brush_motor_driver_4.PWMCLK clock
add_connection HPS_tabby.H2CLK brush_motor_driver_5.PWMCLK clock
add_connection HPS_tabby.H2CLK brush_motor_driver_6.PWMCLK clock
add_connection HPS_tabby.H2CLK brush_motor_driver_7.PWMCLK clock
add_connection HPS_tabby.H2CLK brush_motor_driver_8.PWMCLK clock
add_connection HPS_tabby.H2CLK fan_motor_driver_0.PWMCLK clock
add_connection HPS_tabby.H2CLK fan_motor_driver_1.PWMCLK clock
add_connection HPS_tabby.H2CLK fan_motor_driver_2.PWMCLK clock
add_connection HPS_tabby.H2CLK fan_motor_driver_3.PWMCLK clock
add_connection HPS_tabby.H2CLK fan_motor_driver_4.PWMCLK clock
add_connection HPS_tabby.H2CLK fan_motor_driver_5.PWMCLK clock
add_connection HPS_tabby.H2CLK fan_motor_driver_6.PWMCLK clock
add_connection HPS_tabby.H2CLK fan_motor_driver_7.PWMCLK clock
add_connection HPS_tabby.H2CLK grid_PWM_0.PWMCLK clock
add_connection HPS_tabby.H2CLK steering_driver_0.pwmclk clock
add_connection HPS_tabby.H2CLK steering_driver_1.pwmclk clock
add_connection HPS_tabby.H2CLK steering_driver_2.pwmclk clock
add_connection HPS_tabby.H2CLK steering_driver_3.pwmclk clock
add_connection HPS_tabby.H2CLK steering_driver_4.pwmclk clock
add_connection HPS_tabby.H2CLK steering_driver_5.pwmclk clock
add_connection HPS_tabby.H2CLK steering_driver_6.pwmclk clock
add_connection HPS_tabby.H2CLK steering_driver_7.pwmclk clock
add_connection HPS_tabby.H2CLK steering_driver_8.pwmclk clock
add_connection HPS_tabby.H2CLK steering_driver_9.pwmclk clock
add_connection HPS_tabby.H2CLK steering_driver_10.pwmclk clock
add_connection HPS_tabby.H2CLK steering_driver_11.pwmclk clock
add_connection HPS_tabby.H2CLK steering_driver_12.pwmclk clock
add_connection HPS_tabby.H2CLK steering_driver_13.pwmclk clock
add_connection HPS_tabby.H2CLK steering_driver_14.pwmclk clock
add_connection HPS_tabby.H2CLK steering_driver_15.pwmclk clock
add_connection HPS_tabby.H2CLK step_motor_driver_0.PWMCLK clock
add_connection HPS_tabby.H2CLK step_motor_driver_1.PWMCLK clock
add_connection HPS_tabby.H2CLK step_motor_driver_2.PWMCLK clock
add_connection HPS_tabby.H2CLK step_motor_driver_3.PWMCLK clock
add_connection HPS_tabby.H2CLK step_motor_driver_4.PWMCLK clock
add_connection HPS_tabby.H2CLK step_motor_driver_5.PWMCLK clock
add_connection HPS_tabby.H2CLK step_motor_driver_6.PWMCLK clock
add_connection HPS_tabby.H2CLK step_motor_driver_7.PWMCLK clock
add_connection HPS_tabby.H2CLK step_motor_driver_8.PWMCLK clock
add_connection HPS_tabby.H2CLK subdivision_step_motor_driver_0.pwmclk clock
add_connection HPS_tabby.MCLK AD7490_0.mclk clock
add_connection HPS_tabby.MCLK AD7490_1.mclk clock
add_connection HPS_tabby.MCLK AM2301_0.MCLK clock
add_connection HPS_tabby.MCLK AM2301_1.MCLK clock
add_connection HPS_tabby.MCLK AM2301_2.MCLK clock
add_connection HPS_tabby.MCLK AM2301_3.MCLK clock
add_connection HPS_tabby.MCLK AM2301_4.MCLK clock
add_connection HPS_tabby.MCLK AM2301_5.MCLK clock
add_connection HPS_tabby.MCLK AM2301_6.MCLK clock
add_connection HPS_tabby.MCLK AM2301_7.MCLK clock
add_connection HPS_tabby.MCLK AM2301_8.MCLK clock
add_connection HPS_tabby.MCLK basic_FuncLED_0.MCLK clock
add_connection HPS_tabby.MCLK basic_FuncLED_1.MCLK clock
add_connection HPS_tabby.MCLK basic_FuncLED_2.MCLK clock
add_connection HPS_tabby.MCLK basic_FuncLED_3.MCLK clock
add_connection HPS_tabby.MCLK basic_ShieldCtrl.MCLK clock
add_connection HPS_tabby.MCLK basic_SysID.MCLK clock
add_connection HPS_tabby.MCLK brush_motor_driver_0.MCLK clock
add_connection HPS_tabby.MCLK brush_motor_driver_1.MCLK clock
add_connection HPS_tabby.MCLK brush_motor_driver_2.MCLK clock
add_connection HPS_tabby.MCLK brush_motor_driver_3.MCLK clock
add_connection HPS_tabby.MCLK brush_motor_driver_4.MCLK clock
add_connection HPS_tabby.MCLK brush_motor_driver_5.MCLK clock
add_connection HPS_tabby.MCLK brush_motor_driver_6.MCLK clock
add_connection HPS_tabby.MCLK brush_motor_driver_7.MCLK clock
add_connection HPS_tabby.MCLK brush_motor_driver_8.MCLK clock
add_connection HPS_tabby.MCLK fan_motor_driver_0.MCLK clock
add_connection HPS_tabby.MCLK fan_motor_driver_1.MCLK clock
add_connection HPS_tabby.MCLK fan_motor_driver_2.MCLK clock
add_connection HPS_tabby.MCLK fan_motor_driver_3.MCLK clock
add_connection HPS_tabby.MCLK fan_motor_driver_4.MCLK clock
add_connection HPS_tabby.MCLK fan_motor_driver_5.MCLK clock
add_connection HPS_tabby.MCLK fan_motor_driver_6.MCLK clock
add_connection HPS_tabby.MCLK fan_motor_driver_7.MCLK clock
add_connection HPS_tabby.MCLK grid_PIO26_A.MCLK clock
add_connection HPS_tabby.MCLK grid_PIO26_B.MCLK clock
add_connection HPS_tabby.MCLK grid_PWM_0.MCLK clock
add_connection HPS_tabby.MCLK grid_PWM_1.MCLK clock
add_connection HPS_tabby.MCLK grid_PWM_1.PWMCLK clock
add_connection HPS_tabby.MCLK grid_PWM_2.MCLK clock
add_connection HPS_tabby.MCLK grid_PWM_2.PWMCLK clock
add_connection HPS_tabby.MCLK position_encoder_0.MCLK clock
add_connection HPS_tabby.MCLK position_encoder_1.MCLK clock
add_connection HPS_tabby.MCLK position_encoder_2.MCLK clock
add_connection HPS_tabby.MCLK position_encoder_3.MCLK clock
add_connection HPS_tabby.MCLK position_encoder_4.MCLK clock
add_connection HPS_tabby.MCLK position_encoder_5.MCLK clock
add_connection HPS_tabby.MCLK position_encoder_6.MCLK clock
add_connection HPS_tabby.MCLK position_encoder_7.MCLK clock
add_connection HPS_tabby.MCLK position_encoder_8.MCLK clock
add_connection HPS_tabby.MCLK steering_driver_0.mclk clock
add_connection HPS_tabby.MCLK steering_driver_1.mclk clock
add_connection HPS_tabby.MCLK steering_driver_2.mclk clock
add_connection HPS_tabby.MCLK steering_driver_3.mclk clock
add_connection HPS_tabby.MCLK steering_driver_4.mclk clock
add_connection HPS_tabby.MCLK steering_driver_5.mclk clock
add_connection HPS_tabby.MCLK steering_driver_6.mclk clock
add_connection HPS_tabby.MCLK steering_driver_7.mclk clock
add_connection HPS_tabby.MCLK steering_driver_8.mclk clock
add_connection HPS_tabby.MCLK steering_driver_9.mclk clock
add_connection HPS_tabby.MCLK steering_driver_10.mclk clock
add_connection HPS_tabby.MCLK steering_driver_11.mclk clock
add_connection HPS_tabby.MCLK steering_driver_12.mclk clock
add_connection HPS_tabby.MCLK steering_driver_13.mclk clock
add_connection HPS_tabby.MCLK steering_driver_14.mclk clock
add_connection HPS_tabby.MCLK steering_driver_15.mclk clock
add_connection HPS_tabby.MCLK step_motor_driver_0.MCLK clock
add_connection HPS_tabby.MCLK step_motor_driver_1.MCLK clock
add_connection HPS_tabby.MCLK step_motor_driver_2.MCLK clock
add_connection HPS_tabby.MCLK step_motor_driver_3.MCLK clock
add_connection HPS_tabby.MCLK step_motor_driver_4.MCLK clock
add_connection HPS_tabby.MCLK step_motor_driver_5.MCLK clock
add_connection HPS_tabby.MCLK step_motor_driver_6.MCLK clock
add_connection HPS_tabby.MCLK step_motor_driver_7.MCLK clock
add_connection HPS_tabby.MCLK step_motor_driver_8.MCLK clock
add_connection HPS_tabby.MCLK subdivision_step_motor_driver_0.mclk clock
add_connection HPS_tabby.MCLK test_LEDState.MCLK clock
add_connection HPS_tabby.MRST AD7490_0.mrst reset
add_connection HPS_tabby.MRST AD7490_1.mrst reset
add_connection HPS_tabby.MRST AM2301_0.MRST reset
add_connection HPS_tabby.MRST AM2301_1.MRST reset
add_connection HPS_tabby.MRST AM2301_2.MRST reset
add_connection HPS_tabby.MRST AM2301_3.MRST reset
add_connection HPS_tabby.MRST AM2301_4.MRST reset
add_connection HPS_tabby.MRST AM2301_5.MRST reset
add_connection HPS_tabby.MRST AM2301_6.MRST reset
add_connection HPS_tabby.MRST AM2301_7.MRST reset
add_connection HPS_tabby.MRST AM2301_8.MRST reset
add_connection HPS_tabby.MRST basic_FuncLED_0.MRST reset
add_connection HPS_tabby.MRST basic_FuncLED_1.MRST reset
add_connection HPS_tabby.MRST basic_FuncLED_2.MRST reset
add_connection HPS_tabby.MRST basic_FuncLED_3.MRST reset
add_connection HPS_tabby.MRST basic_ShieldCtrl.MRST reset
add_connection HPS_tabby.MRST basic_SysID.MRST reset
add_connection HPS_tabby.MRST brush_motor_driver_0.MRST reset
add_connection HPS_tabby.MRST brush_motor_driver_0.PWMRST reset
add_connection HPS_tabby.MRST brush_motor_driver_1.MRST reset
add_connection HPS_tabby.MRST brush_motor_driver_1.PWMRST reset
add_connection HPS_tabby.MRST brush_motor_driver_2.MRST reset
add_connection HPS_tabby.MRST brush_motor_driver_2.PWMRST reset
add_connection HPS_tabby.MRST brush_motor_driver_3.MRST reset
add_connection HPS_tabby.MRST brush_motor_driver_3.PWMRST reset
add_connection HPS_tabby.MRST brush_motor_driver_4.MRST reset
add_connection HPS_tabby.MRST brush_motor_driver_4.PWMRST reset
add_connection HPS_tabby.MRST brush_motor_driver_5.MRST reset
add_connection HPS_tabby.MRST brush_motor_driver_5.PWMRST reset
add_connection HPS_tabby.MRST brush_motor_driver_6.MRST reset
add_connection HPS_tabby.MRST brush_motor_driver_6.PWMRST reset
add_connection HPS_tabby.MRST brush_motor_driver_7.MRST reset
add_connection HPS_tabby.MRST brush_motor_driver_7.PWMRST reset
add_connection HPS_tabby.MRST brush_motor_driver_8.MRST reset
add_connection HPS_tabby.MRST brush_motor_driver_8.PWMRST reset
add_connection HPS_tabby.MRST fan_motor_driver_0.MRST reset
add_connection HPS_tabby.MRST fan_motor_driver_0.PWMRST reset
add_connection HPS_tabby.MRST fan_motor_driver_1.MRST reset
add_connection HPS_tabby.MRST fan_motor_driver_1.PWMRST reset
add_connection HPS_tabby.MRST fan_motor_driver_2.MRST reset
add_connection HPS_tabby.MRST fan_motor_driver_2.PWMRST reset
add_connection HPS_tabby.MRST fan_motor_driver_3.MRST reset
add_connection HPS_tabby.MRST fan_motor_driver_3.PWMRST reset
add_connection HPS_tabby.MRST fan_motor_driver_4.MRST reset
add_connection HPS_tabby.MRST fan_motor_driver_4.PWMRST reset
add_connection HPS_tabby.MRST fan_motor_driver_5.MRST reset
add_connection HPS_tabby.MRST fan_motor_driver_5.PWMRST reset
add_connection HPS_tabby.MRST fan_motor_driver_6.MRST reset
add_connection HPS_tabby.MRST fan_motor_driver_6.PWMRST reset
add_connection HPS_tabby.MRST fan_motor_driver_7.MRST reset
add_connection HPS_tabby.MRST fan_motor_driver_7.PWMRST reset
add_connection HPS_tabby.MRST grid_PIO26_A.MRST reset
add_connection HPS_tabby.MRST grid_PIO26_B.MRST reset
add_connection HPS_tabby.MRST grid_PWM_0.MRST reset
add_connection HPS_tabby.MRST grid_PWM_0.PWMRST reset
add_connection HPS_tabby.MRST grid_PWM_1.MRST reset
add_connection HPS_tabby.MRST grid_PWM_1.PWMRST reset
add_connection HPS_tabby.MRST grid_PWM_2.MRST reset
add_connection HPS_tabby.MRST grid_PWM_2.PWMRST reset
add_connection HPS_tabby.MRST position_encoder_0.MRST reset
add_connection HPS_tabby.MRST position_encoder_1.MRST reset
add_connection HPS_tabby.MRST position_encoder_2.MRST reset
add_connection HPS_tabby.MRST position_encoder_3.MRST reset
add_connection HPS_tabby.MRST position_encoder_4.MRST reset
add_connection HPS_tabby.MRST position_encoder_5.MRST reset
add_connection HPS_tabby.MRST position_encoder_6.MRST reset
